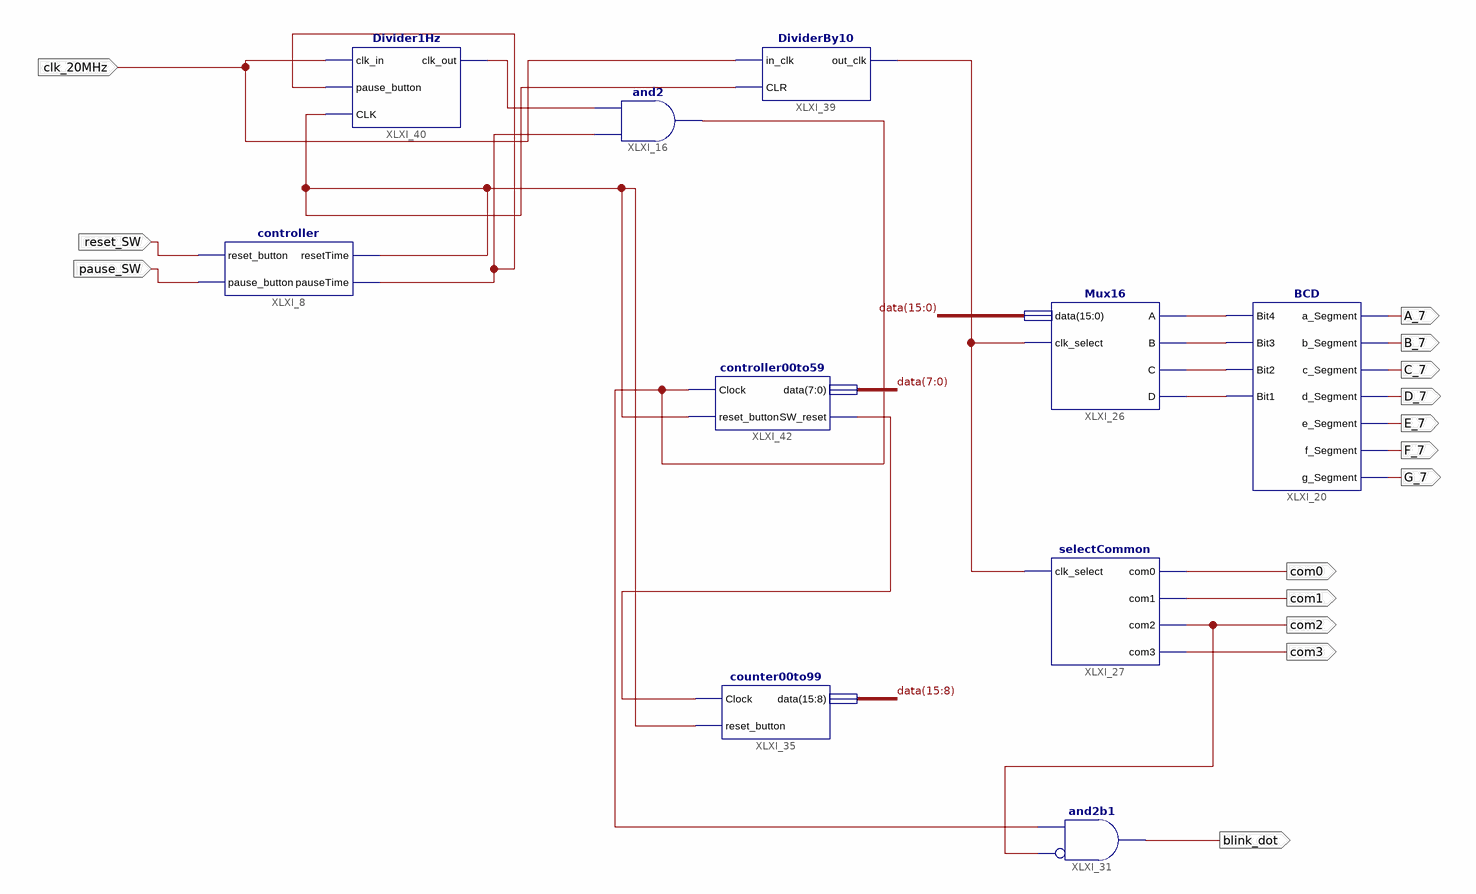
[diagram p0: schematic sheet 1]
// Xilinx ISE schematic Timer.sch (spartan6) as structural Verilog: 10 symbols, 15 ports
module Timer (
  input  clk_20MHz,
  input  reset_SW,
  input  pause_SW,
  output A_7,
  output B_7,
  output C_7,
  output D_7,
  output E_7,
  output F_7,
  output G_7,
  output com0,
  output com1,
  output com2,
  output com3,
  output blink_dot
);

  wire XLXN_36, XLXN_91, XLXN_92, XLXN_93, XLXN_94, XLXN_107, XLXN_123, XLXN_135, XLXN_146, XLXN_148;
  wire [15:0] data;

  and XLXI_16 (XLXN_135, XLXN_107, XLXN_148);
  Mux16 XLXI_26 (.A(XLXN_91), .B(XLXN_92), .C(XLXN_93), .clk_select(XLXN_123), .D(XLXN_94), .data(data));
  BCD XLXI_20 (
    .a_Segment(A_7), .Bit1(XLXN_94), .Bit2(XLXN_93), .Bit3(XLXN_92), .Bit4(XLXN_91), .b_Segment(B_7),
    .c_Segment(C_7), .d_Segment(D_7), .e_Segment(E_7), .f_Segment(F_7), .g_Segment(G_7));
  selectCommon XLXI_27 (.clk_select(XLXN_123), .com0(com0), .com1(com1), .com2(com2), .com3(com3));
  and XLXI_31 (blink_dot, ~com2, XLXN_135);  // and2b1
  counter00to99 XLXI_35 (.Clock(XLXN_36), .reset_button(XLXN_146), .data(data[15:8]));
  controller XLXI_8 (.pauseTime(XLXN_107), .pause_button(pause_SW), .resetTime(XLXN_146), .reset_button(reset_SW));
  DividerBy10 XLXI_39 (.CLR(XLXN_146), .in_clk(clk_20MHz), .out_clk(XLXN_123));
  Divider1Hz XLXI_40 (.CLK(XLXN_146), .clk_in(clk_20MHz), .pause_button(XLXN_107), .clk_out(XLXN_148));
  controller00to59 XLXI_42 (.reset_button(XLXN_146), .Clock(XLXN_135), .SW_reset(XLXN_36), .data(data[7:0]));

  // Notes on the sheet:
  //   CLOCK_DEDICATED_ROUTE on signal reset_SW = FALSE
  //   CLOCK_DEDICATED_ROUTE on signal pause_SW = False
endmodule
